# Altium schematic sheet DRV8301_NoPower.SchDoc
size A3; SheetNumber: 3; SheetTotal: 4
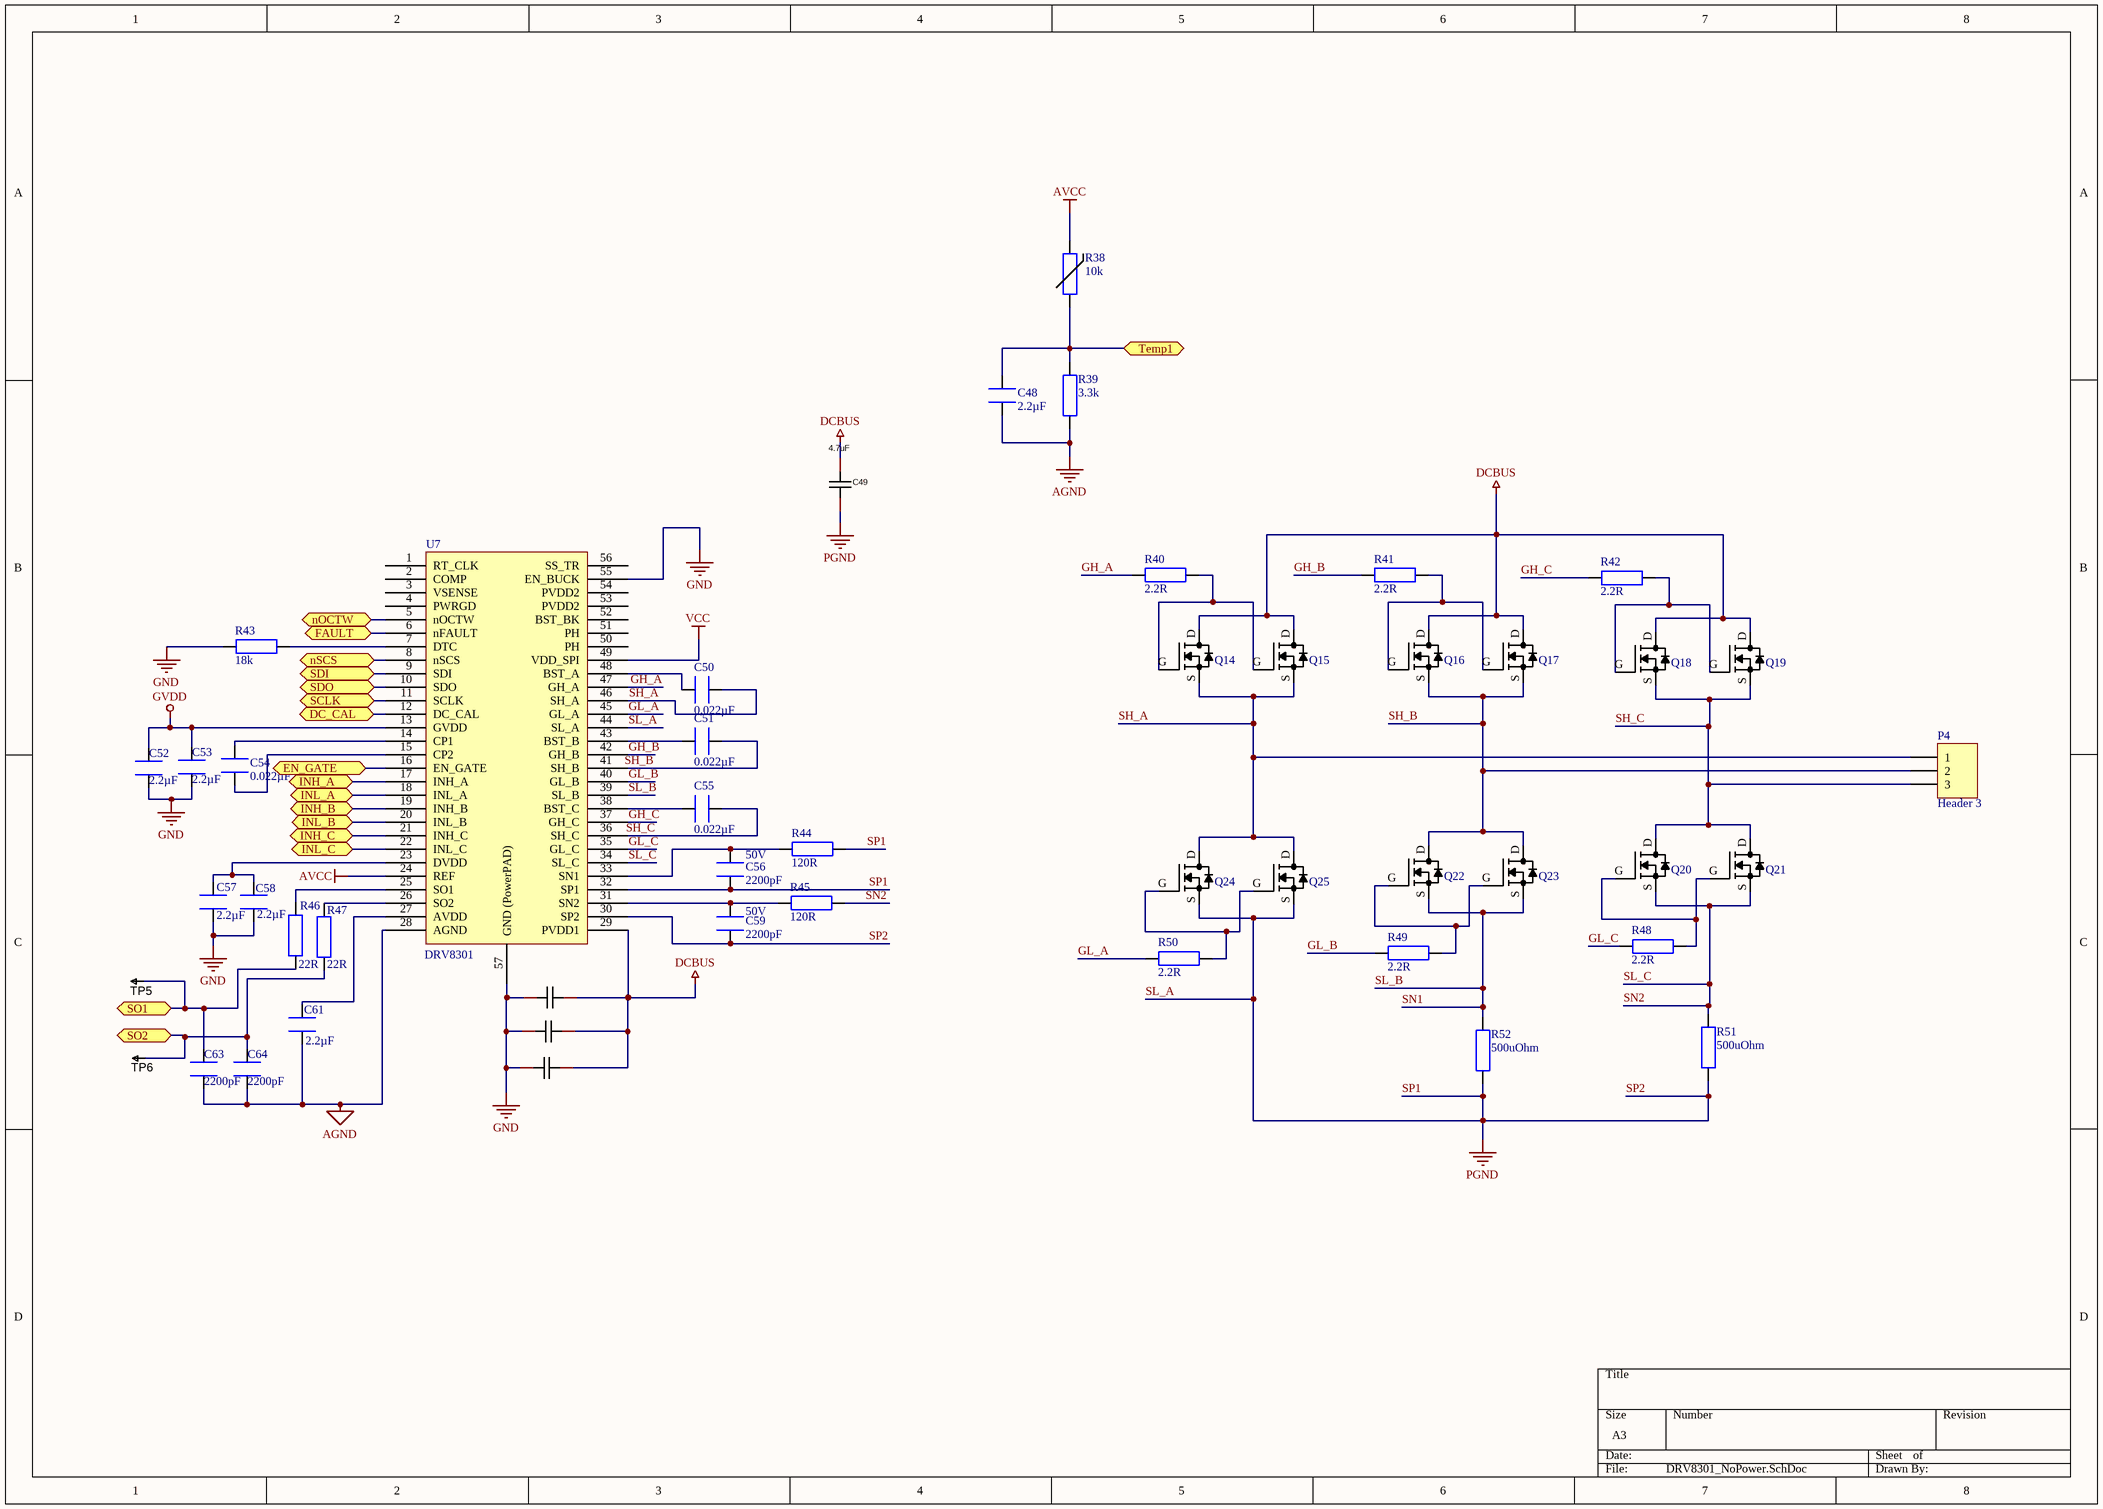
[diagram p0: DRV8301_NoPower.SchDoc]

## Parts
C48  2.2µF  [CAPC1608X09L]
C49  4.7uF  [C1210]
C50  0.022µF  [CAPC1608X09L]
C51  0.022µF  [CAPC1608X09L]
C52  2.2µF  [CAPC1608X09L]
C53  2.2µF  [CAPC1608X09L]
C54  0.022µF  [CAPC1608X09L]
C55  0.022µF  [CAPC1608X09L]
C56  2200pF  Voltage - Rated: 50V  [CAPC1608X09L]
C57  2.2µF  [CAPC1608X09L]
C58  2.2µF  [CAPC1608X09L]
C59  2200pF  Voltage - Rated: 50V  [CAPC1608X09L]
C60  4.7uF  [C1210]  (value not drawn)
C61  2.2µF  [CAPC1608X09L]
C62  4.7uF  [C1210]  (value not drawn)
C63  2200pF  [CAPC1608X09L]
C64  2200pF  [CAPC1608X09L]
C65  4.7uF  [C1210]  (value not drawn)
P4  Header 3  [CONN-TH_MR30-M]
Q14  NTMFS5C628NLT  [SO8FL]  (value not drawn)
Q15  NTMFS5C628NLT  [SO8FL]  (value not drawn)
Q16  NTMFS5C628NLT  [SO8FL]  (value not drawn)
Q17  NTMFS5C628NLT  [SO8FL]  (value not drawn)
Q18  NTMFS5C628NLT  [SO8FL]  (value not drawn)
Q19  NTMFS5C628NLT  [SO8FL]  (value not drawn)
Q20  NTMFS5C628NLT  [SO8FL]  (value not drawn)
Q21  NTMFS5C628NLT  [SO8FL]  (value not drawn)
Q22  NTMFS5C628NLT  [SO8FL]  (value not drawn)
Q23  NTMFS5C628NLT  [SO8FL]  (value not drawn)
Q24  NTMFS5C628NLT  [SO8FL]  (value not drawn)
Q25  NTMFS5C628NLT  [SO8FL]  (value not drawn)
R38  value 10k  [RESC1005X40N]  (hidden comment: NCP15XH103F03RC)
R39  3.3k  [RESC1608X55N]
R40  2.2R  [RESC1608X55N]
R41  2.2R  [RESC1608X55N]
R42  2.2R  [RESC1608X55N]
R43  18k  [RESC1608X55N]
R44  120R  [RESC1608X55N]
R45  120R  [RESC1608X55N]
R46  22R  [RESC1608X55N]
R47  22R  [RESC1608X55N]
R48  2.2R  [RESC1608X55N]
R49  2.2R  [RESC1608X55N]
R50  2.2R  [RESC1608X55N]
R51  value 500uOhm  [RESC6432X09N]  (hidden comment: CSR2512C0R0005F)
R52  value 500uOhm  [RESC6432X09N]  (hidden comment: CSR2512C0R0005F)
TP5  TESTPOINT  [TP-R30]  (value not drawn)  (no BOM)
TP6  TESTPOINT  [TP-R30]  (value not drawn)  (no BOM)
U7  DRV8301  [TSSOP50P810X120_HS-57N]

## Ports
DC_CAL (bidir), EN_GATE (bidir), FAULT (bidir), INH_A (bidir), INH_B (bidir), INH_C (bidir), INL_A (bidir), INL_B (bidir), INL_C (bidir), nOCTW (bidir), nSCS (bidir), SCLK (bidir), SDI (bidir), SDO (bidir), SO1 (bidir), SO2 (bidir), Temp1 (bidir)

## Nets
AGND: C48.1 C61.1 C63.1 C64.1 R39.1 U7.28(AGND)
AVCC: R38.2 U7.24(REF)
DCBUS: C49.2 C60.2 C62.2 C65.2 Q14.D Q15.D Q16.D Q17.D Q18.D Q19.D U7.29(PVDD1)
GND: C52.1 C53.1 C57.2 C58.2 C60.1 C62.1 C65.1 R43.2 U7.55(EN_BUCK) U7.57(GND_(PowerPAD))
GVDD: C52.2 C53.2 U7.13(GVDD)
SL_A: C49.1 C56.1 C59.1 Q24.S Q25.S R44.1 R51.1 R52.1 U7.30(SP2) U7.32(SP1) U7.44(SL_A)  [also labelled PGND, SP1, SP2]
VCC: U7.49(VDD_SPI)
DC_CAL: U7.12(DC_CAL) ; port DC_CAL
EN_GATE: U7.16(EN_GATE) ; port EN_GATE
FAULT: U7.6(nFAULT) ; port FAULT
GH_A: R40.2 U7.47(GH_A)
GH_B: R41.2 U7.42(GH_B)
GH_C: R42.2 U7.37(GH_C)
GL_A: R50.2 U7.45(GL_A)
GL_B: R49.2 U7.40(GL_B)
GL_C: R48.2 U7.35(GL_C)
INH_A: U7.17(INH_A) ; port INH_A
INH_B: U7.19(INH_B) ; port INH_B
INH_C: U7.21(INH_C) ; port INH_C
INL_A: U7.18(INL_A) ; port INL_A
INL_B: U7.20(INL_B) ; port INL_B
INL_C: U7.22(INL_C) ; port INL_C
nOCTW: U7.5(nOCTW) ; port nOCTW
nSCS: U7.8(nSCS) ; port nSCS
SCLK: U7.11(SCLK) ; port SCLK
SDI: U7.9(SDI) ; port SDI
SDO: U7.10(SDO) ; port SDO
SH_A: C50.1 P4.1 Q14.S Q15.S Q24.D Q25.D U7.46(SH_A)
SH_B: C51.1 P4.2 Q16.S Q17.S Q22.D Q23.D U7.41(SH_B)
SH_C: C55.1 P4.3 Q18.S Q19.S Q20.D Q21.D U7.36(SH_C)
SL_B: Q22.S Q23.S R52.2 U7.39(SL_B)  [also labelled SN1]
SL_C: Q20.S Q21.S R45.1 R51.2 U7.34(SL_C)  [also labelled SN2]
SO1: C63.2 R46.2 TP5.1 ; port SO1
SO2: C64.2 R47.2 TP6.1 ; port SO2
Temp1: C48.2 R38.1 R39.2 ; port Temp1
NetC50_2: C50.2 U7.48(BST_A)
NetC51_2: C51.2 U7.43(BST_B)
NetC54_1: C54.1 U7.14(CP1)
NetC54_2: C54.2 U7.15(CP2)
NetC55_2: C55.2 U7.38(BST_C)
NetC56_2: C56.2 R44.2 U7.33(SN1)
NetC57_1: C57.1 C58.1 U7.23(DVDD)
NetC59_2: C59.2 R45.2 U7.31(SN2)
NetC61_2: C61.2 U7.27(AVDD)
NetQ14_G: Q14.G Q15.G R40.1
NetQ16_G: Q16.G Q17.G R41.1
NetQ18_G: Q18.G Q19.G R42.1
NetQ20_G: Q20.G Q21.G R48.1
NetQ22_G: Q22.G Q23.G R49.1
NetQ24_G: Q24.G Q25.G R50.1
NetR43_1: R43.1 U7.7(DTC)
NetR46_1: R46.1 U7.25(SO1)
NetR47_1: R47.1 U7.26(SO2)

Not connected (* = marked no-connect by the designer): U7 1(RT_CLK) 2(COMP) 3(VSENSE) 4(PWRGD) 50(PH) 51(PH) 52(BST_BK) 53(PVDD2) 54(PVDD2) 56(SS_TR)

## Library data of the parts
C48 C52 C53 C57 C58 C61 = GRM188R61C225KE15D: CAP CER 2.2UF 16V X5R 0603; Manufacturer: Murata Electronics North America; Tolerance: ±10%; Supplier 1: Digi-Key; Supplier Part Number 1: 490-3296-1-ND; Manufacturer Part Number: GRM188R61C225KE15D; RoHS: RoHS Compliant; Category: Capacitors; Stock 1: 1255740; Pricing 1: 1=0.12, 10=0.08, 50=0.046, 100=0.038, 250=0.032, 500=0.0268, 1000=0.022 (USD); Packaging: Cut Tape (CT); Capacitance: 2.2µF; Voltage - Rated: 16V; Temperature Coefficient: X5R; Mounting Type: Surface Mount, MLCC; Operating Temperature: -55°C ~ 85°C; Applications: General Purpose; Ratings: -; Package / Case: 0603 (1608 Metric); Size / Dimension: 0.063" L x 0.031" W (1.60mm x 0.80mm); Height - Seated (Max): -; Thickness (Max): 0.035" (0.90mm); Lead Spacing: -; Features: -; Lead Style: -; ComponentLink1URL: http://www.murata.com/~/media/webrenewal/support/library/catalog/products/capacitor/mlcc/c02e.pdf; ComponentLink1Description: http://www.murata.com/~/media/webrenewal/support/library/catalog/products/capacitor/mlcc/c02e.pdf
C49 C60 C62 C65 = C1210X7R475K630NT: 4.7uF 63V 1210封装; Manufacturer: SANYEAR(叁叶源); Add into BOM: yes; Temperature Coefficient: X7R; Name: 4.7uF; Symbol: C1210X7R475K630NT; Device: C1210X7R475K630NT; Manufacturer Part: C1210X7R475K630NT; Value: 4.7uF; Supplier Part: C2911397; Supplier Footprint: 1210; JLCPCB Part Class: Extended Part; Datasheet: https://atta.szlcsc.com/upload/public/pdf/source/20210902/8F39E0658D363F48630A7672568BDC14.pdf; Supplier: LCSC; Convert to PCB: yes; LCSC Part Name: 4.7uF 63V; Voltage Rated: 63V
C50 C51 C54 C55 = GRM188R71H223KA01D: CAP CER 0.022UF 50V X7R 0603; Manufacturer: Murata Electronics North America; Tolerance: ±10%; Supplier 1: Digi-Key; Supplier Part Number 1: 490-1517-2-ND; Manufacturer Part Number: GRM188R71H223KA01D; RoHS: RoHS Compliant; Category: Capacitors; Pricing 1: 4000=0.01518, 8000=0.01386, 12000=0.0132 (USD); Packaging: Tape & Reel (TR); Capacitance: 0.022µF; Voltage - Rated: 50V; Temperature Coefficient: X7R; Mounting Type: Surface Mount, MLCC; Operating Temperature: -55°C ~ 125°C; Applications: General Purpose; Ratings: -; Package / Case: 0603 (1608 Metric); Size / Dimension: 0.063" L x 0.032" W (1.60mm x 0.80mm); Height - Seated (Max): -; Thickness (Max): 0.035" (0.90mm); Lead Spacing: -; Features: -; Lead Style: -; ComponentLink1URL: http://search.murata.co.jp/Ceramy/image/img/A01X/G101/ENG/GRM188R71H223KA01-01.pdf; ComponentLink1Description: http://search.murata.co.jp/Ceramy/image/img/A01X/G101/ENG/GRM188R71H223KA01-01.pdf; Stock: 608000; Part Status: Active; Supplier 2: Digi-Key; Supplier Part Number 2: 490-1517-1-ND; Pricing 2: 1=0.11, 10=0.083, 100=0.0372, 500=0.02656, 1000=0.02087 (USD)
C56 C59 C63 C64 = GRM1885C1H222JA01D: CAP CER 2200PF 50V NP0 0603; Manufacturer: Murata Electronics North America; Tolerance: ±5%; Temperature Coefficient: C0G, NP0; Supplier 1: Digi-Key; Supplier Part Number 1: 490-1459-1-ND; RoHS: RoHS Compliant; Category: Capacitors; Stock 1: 850589; Pricing 1: 1=0.11, 10=0.08, 25=0.058, 50=0.0434, 100=0.0355, 250=0.02972, 500=0.02536, 1000=0.01992 (USD); Packaging: Cut Tape (CT); Capacitance: 2200pF; Mounting Type: Surface Mount, MLCC; Operating Temperature: -55°C ~ 125°C; Applications: General Purpose; Ratings: -; Package / Case: 0603 (1608 Metric); Size / Dimension: 0.063" L x 0.031" W (1.60mm x 0.80mm); Height - Seated (Max): -; Thickness (Max): 0.035" (0.90mm); Lead Spacing: -; Features: -; Lead Style: -; ComponentLink1URL: http://www.murata.com/~/media/webrenewal/support/library/catalog/products/capacitor/mlcc/c02e.ashx; ComponentLink1Description: http://www.murata.com/~/media/webrenewal/support/library/catalog/products/capacitor/mlcc/c02e.ashx; Part Status: Active
  C63 C64: Voltage - Rated: 50V
P4 = Header 3: Header, 3-Pin; LatestRevisionDate: 17-Jul-2002; LatestRevisionNote: Re-released for DXP Platform.; Publisher: Altium Limited
Q14-Q25 = NTMFS5C628NLT: MOSFET N-CH 60V SO8FL; Manufacturer: ON Semiconductor; Manufacturer Part Number: NTMFS5C628NLT1G; FET Type: N-Channel; Drive Voltage (Max Rds On,  Min Rds On): 4.5V, 10V; Vgs(th) (Max) @ Id: 2V @ 135µA; Gate Charge (Qg) (Max) @ Vgs: 52nC @ 10V; Input Capacitance (Ciss) (Max) @ Vds: 3600pF @ 25V; Vgs (Max): ±20V; Power Dissipation (Max): 3.7W (Ta), 110W (Tc); Rds On (Max) @ Id, Vgs: 2.4 mOhm @ 50A, 10V; Supplier 1: Digi-Key; Supplier Part Number 1: NTMFS5C628NLT1GOSCT-ND; RoHS: RoHS Compliant; Category: Discrete Semiconductor Products; Stock: 1490; Pricing 1: 1=1.8, 10=1.627, 100=1.3078, 500=1.01716 (USD); Packaging: Cut Tape (CT); Part Status: Active; Technology: MOSFET (Metal Oxide); Current - Continuous Drain (Id) @ 25°C: -; FET Feature: -; Operating Temperature: -55°C ~ 175°C (TJ); Mounting Type: Surface Mount; Supplier Device Package: 5-DFN (5x6) (8-SOFL); Package / Case: 8-PowerTDFN; ComponentLink1URL: http://www.onsemi.com/pub/Collateral/NTMFS5C628NL-D.PDF; ComponentLink1Description: http://www.onsemi.com/pub/Collateral/NTMFS5C628NL-D.PDF; Supplier 2: Digi-Key; Supplier Part Number 2: NTMFS5C628NLT1GOSTR-ND; Pricing 2: 1500=0.81823 (USD)
R38 = NCP15XH103F03RC: THERMISTOR 10K OHM NTC 0402 SMD
R39 = RC0603FR-073K3L: RES SMD 3.3K OHM 1% 1/10W 0603; Manufacturer: Yageo; Power (Watts): 0.1W, 1/10W; Temperature Coefficient: ±100ppm/°C; Supplier 1: Digi-Key; Supplier Part Number 1: 311-3.30KHRCT-ND; Manufacturer Part Number: RC0603FR-073K3L; RoHS: RoHS Compliant; Category: Resistors; Stock 1: 420019; Pricing 1: 1=0.1, 10=0.014, 25=0.01, 100=0.0057, 250=0.00436, 500=0.00348, 1000=0.00257, 2500=0.00223 (USD); Packaging: Cut Tape (CT); Resistance (Ohms): 3.3k; Tolerance: ±1%; Composition: Thick Film; Features: Moisture Resistant; Operating Temperature: -55°C ~ 155°C; Package / Case: 0603 (1608 Metric); Supplier Device Package: 0603; Size / Dimension: 0.063" L x 0.031" W (1.60mm x 0.80mm); Height: 0.022" (0.55mm); Number of Terminations: 2; ComponentLink1URL: http://www.yageo.com/documents/recent/PYu-RC_Group_51_RoHS_L_04.pdf; ComponentLink1Description: http://www.yageo.com/documents/recent/PYu-RC_Group_51_RoHS_L_04.pdf
R40-R42 R48-R50 = RC0603FR-072R2L: RES SMD 2.2 OHM 1% 1/10W 0603; Manufacturer: Yageo; Resistance (Ohms): 2.2; Power (Watts): 0.1W, 1/10W; Temperature Coefficient: ±200ppm/°C; Supplier 1: Digi-Key; Supplier Part Number 1: 311-2.2HRCT-ND; Manufacturer Part Number: RC0603FR-072R2L; RoHS: RoHS Compliant; Category: Resistors; Stock 1: 16531; Pricing 1: 1=0.1, 10=0.02, 25=0.0144, 100=0.0082, 250=0.00624, 500=0.00498, 1000=0.00367, 2500=0.00319 (USD); Packaging: Cut Tape (CT); Tolerance: ±1%; Composition: Thick Film; Features: Moisture Resistant; Operating Temperature: -55°C ~ 155°C; Package / Case: 0603 (1608 Metric); Supplier Device Package: 0603; Size / Dimension: 0.063" L x 0.031" W (1.60mm x 0.80mm); Height: 0.022" (0.55mm); Number of Terminations: 2; ComponentLink1URL: http://www.yageo.com/documents/recent/PYu-RC_Group_51_RoHS_L_04.pdf; ComponentLink1Description: http://www.yageo.com/documents/recent/PYu-RC_Group_51_RoHS_L_04.pdf
R43 = RC0603FR-0718KL: RES SMD 18K OHM 1% 1/10W 0603; Manufacturer: Yageo; Power (Watts): 0.1W, 1/10W; Temperature Coefficient: ±100ppm/°C; Supplier 1: Digi-Key; Supplier Part Number 1: 311-18.0KHRCT-ND; Manufacturer Part Number: RC0603FR-0718KL; RoHS: RoHS Compliant; Category: Resistors; Stock 1: 0; Pricing 1: 1=0.1, 10=0.014, 25=0.01, 100=0.0057, 250=0.00436, 500=0.00348, 1000=0.00257, 2500=0.00223 (USD); Packaging: Cut Tape (CT); Resistance (Ohms): 18k; Tolerance: ±1%; Composition: Thick Film; Features: Moisture Resistant; Operating Temperature: -55°C ~ 155°C; Package / Case: 0603 (1608 Metric); Supplier Device Package: 0603; Size / Dimension: 0.063" L x 0.031" W (1.60mm x 0.80mm); Height: 0.022" (0.55mm); Number of Terminations: 2; ComponentLink1URL: http://www.yageo.com/documents/recent/PYu-RC_Group_51_RoHS_L_04.pdf; ComponentLink1Description: http://www.yageo.com/documents/recent/PYu-RC_Group_51_RoHS_L_04.pdf
R44 R45 = RC0603FR-07120RL: RES SMD 120 OHM 1% 1/10W 0603; Manufacturer: Yageo; Resistance (Ohms): 120; Power (Watts): 0.1W, 1/10W; Temperature Coefficient: ±100ppm/°C; Supplier 1: Digi-Key; Supplier Part Number 1: 311-120HRCT-ND; Manufacturer Part Number: RC0603FR-07120RL; RoHS: RoHS Compliant; Category: Resistors; Stock 1: 1545282; Pricing 1: 1=0.1, 10=0.014, 25=0.01, 100=0.0057, 250=0.00436, 500=0.00348, 1000=0.00257, 2500=0.00223 (USD); Packaging: Cut Tape (CT); Tolerance: ±1%; Composition: Thick Film; Features: Moisture Resistant; Operating Temperature: -55°C ~ 155°C; Package / Case: 0603 (1608 Metric); Supplier Device Package: 0603; Size / Dimension: 0.063" L x 0.031" W (1.60mm x 0.80mm); Height: 0.022" (0.55mm); Number of Terminations: 2; ComponentLink1URL: http://www.yageo.com/documents/recent/PYu-RC_Group_51_RoHS_L_04.pdf; ComponentLink1Description: http://www.yageo.com/documents/recent/PYu-RC_Group_51_RoHS_L_04.pdf
R46 R47 = RC0603FR-0722RL: RES SMD 22 OHM 1% 1/10W 0603; Manufacturer: Yageo; Resistance (Ohms): 22; Power (Watts): 0.1W, 1/10W; Temperature Coefficient: ±100ppm/°C; Supplier 1: Digi-Key; Supplier Part Number 1: 311-22.0HRCT-ND; Manufacturer Part Number: RC0603FR-0722RL; RoHS: RoHS Compliant; Category: Resistors; Stock 1: 575303; Pricing 1: 1=0.1, 10=0.014, 25=0.01, 100=0.0057, 250=0.00436, 500=0.00348, 1000=0.00257, 2500=0.00223 (USD); Packaging: Cut Tape (CT); Tolerance: ±1%; Composition: Thick Film; Features: Moisture Resistant; Operating Temperature: -55°C ~ 155°C; Package / Case: 0603 (1608 Metric); Supplier Device Package: 0603; Size / Dimension: 0.063" L x 0.031" W (1.60mm x 0.80mm); Height: 0.022" (0.55mm); Number of Terminations: 2; ComponentLink1URL: http://www.yageo.com/documents/recent/PYu-RC_Group_51_RoHS_L_04.pdf; ComponentLink1Description: http://www.yageo.com/documents/recent/PYu-RC_Group_51_RoHS_L_04.pdf
R51 R52 = CSR2512C0R0005F: RES SMD 0.0005 OHM 1% 3W 2512; Manufacturer: Riedon; Temperature Coefficient: ±100ppm/°C; Supplier 1: Digi-Key; Supplier Part Number 1: 696-1183-2-ND; RoHS: RoHS Compliant; Category: Resistors; Stock: 2000; Pricing 1: 2000=0.19817, 6000=0.1937, 10000=0.187, 50000=0.18148 (USD); Packaging: Tape & Reel (TR); Part Status: Active; Tolerance: ±1%; Power (Watts): 3W; Composition: Metal Element; Features: Current Sense; Operating Temperature: -55°C ~ 170°C; Package / Case: 2512 (6432 Metric); Supplier Device Package: 2512; Size / Dimension: 0.250" L x 0.118" W (6.35mm x 3.00mm); Height - Seated (Max): 0.057" (1.45mm); Failure Rate: -; ComponentLink1URL: http://riedon.com/media/pdf/CSR.pdf; ComponentLink1Description: http://riedon.com/media/pdf/CSR.pdf; Supplier 2: Digi-Key; Supplier Part Number 2: 696-1183-1-ND; Pricing 2: 1=0.69, 10=0.574, 25=0.4916, 50=0.4426, 100=0.3852, 250=0.3442, 500=0.27864, 1000=0.22536 (USD); Manufacturer Part Number: CSR2512C0R0005F
TP5 TP6 = TESTPOINT: SMD test pin
U7 = DRV8301: MOTOR DRIVER, 3PH, 56HTSSOP